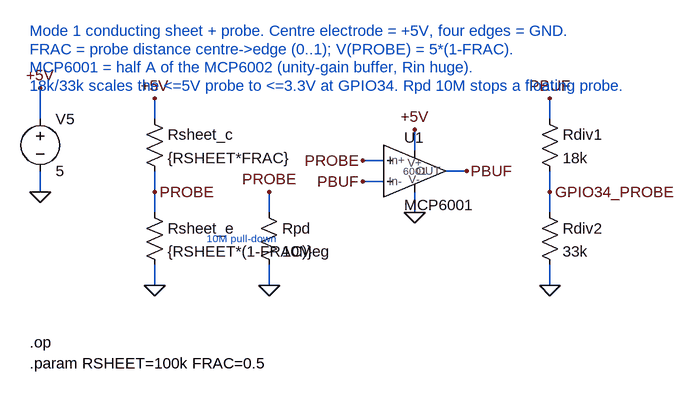
[diagram p0: schematic probe_sheet.asc]
probe_sheet.asc, the LTspice schematic file:
Version 4
SHEET 1 880 760
WIRE -160 -32 -160 16
WIRE -160 96 -160 128
WIRE 16 -16 16 16
WIRE 16 96 16 128
WIRE 16 128 16 160
WIRE 16 240 16 272
WIRE 192 128 192 160
WIRE 192 240 192 272
WIRE 336 80 368 80
WIRE 336 112 368 112
WIRE 416 32 416 64
WIRE 416 128 416 160
WIRE 464 96 496 96
WIRE 624 -16 624 16
WIRE 624 96 624 128
WIRE 624 128 624 160
WIRE 624 240 624 272
FLAG -160 -32 +5V
FLAG -160 128 0
FLAG 16 -16 +5V
FLAG 16 128 PROBE
FLAG 16 272 0
FLAG 192 128 PROBE
FLAG 192 272 0
FLAG 336 80 PROBE
FLAG 336 112 PBUF
FLAG 416 32 +5V
FLAG 416 160 0
FLAG 496 96 PBUF
FLAG 624 -16 PBUF
FLAG 624 128 GPIO34_PROBE
FLAG 624 272 0
SYMBOL voltage -160 0 R0
SYMATTR InstName V5
SYMATTR Value 5
SYMBOL res 0 0 R0
SYMATTR InstName Rsheet_c
SYMATTR Value {RSHEET*FRAC}
SYMBOL res 0 144 R0
SYMATTR InstName Rsheet_e
SYMATTR Value {RSHEET*(1-FRAC)}
SYMBOL res 176 144 R0
SYMATTR InstName Rpd
SYMATTR Value 10Meg
SYMBOL MCP6001 416 96 R0
SYMATTR InstName U1
SYMBOL res 608 0 R0
SYMATTR InstName Rdiv1
SYMATTR Value 18k
SYMBOL res 608 144 R0
SYMATTR InstName Rdiv2
SYMATTR Value 33k
TEXT -176 -120 Left 2 ;Mode 1 conducting sheet + probe. Centre electrode = +5V, four edges = GND.
TEXT -176 -92 Left 2 ;FRAC = probe distance centre->edge (0..1); V(PROBE) = 5*(1-FRAC).
TEXT -176 -64 Left 2 ;MCP6001 = half A of the MCP6002 (unity-gain buffer, Rin huge).
TEXT -176 -36 Left 2 ;18k/33k scales the <=5V probe to <=3.3V at GPIO34. Rpd 10M stops a floating probe.
TEXT 96 200 Left 1 ;10M pull-down
TEXT -176 360 Left 2 !.op
TEXT -176 392 Left 2 !.param RSHEET=100k FRAC=0.5

The netlist it stands for:
* probe_sheet.asc
V5 +5V 0 5
Rsheet_c +5V PROBE {RSHEET*FRAC}
Rsheet_e PROBE 0 {RSHEET*(1-FRAC)}
Rpd PROBE 0 10Meg
XU1 PROBE PBUF +5V 0 PBUF MCP6001  ; pins In+ In- V+ V- OUT
Rdiv1 PBUF GPIO34_PROBE 18k
Rdiv2 GPIO34_PROBE 0 33k
* Mode 1 conducting sheet + probe. Centre electrode = +5V, four edges = GND.
* FRAC = probe distance centre->edge (0..1); V(PROBE) = 5*(1-FRAC).
* MCP6001 = half A of the MCP6002 (unity-gain buffer, Rin huge).
* 18k/33k scales the <=5V probe to <=3.3V at GPIO34. Rpd 10M stops a floating probe.
* 10M pull-down
.op
.param RSHEET=100k FRAC=0.5
.lib MCP6001.lib
.backanno
.end